# Altium schematic sheet Sheet_2.schdoc
size 307 x 218 mm
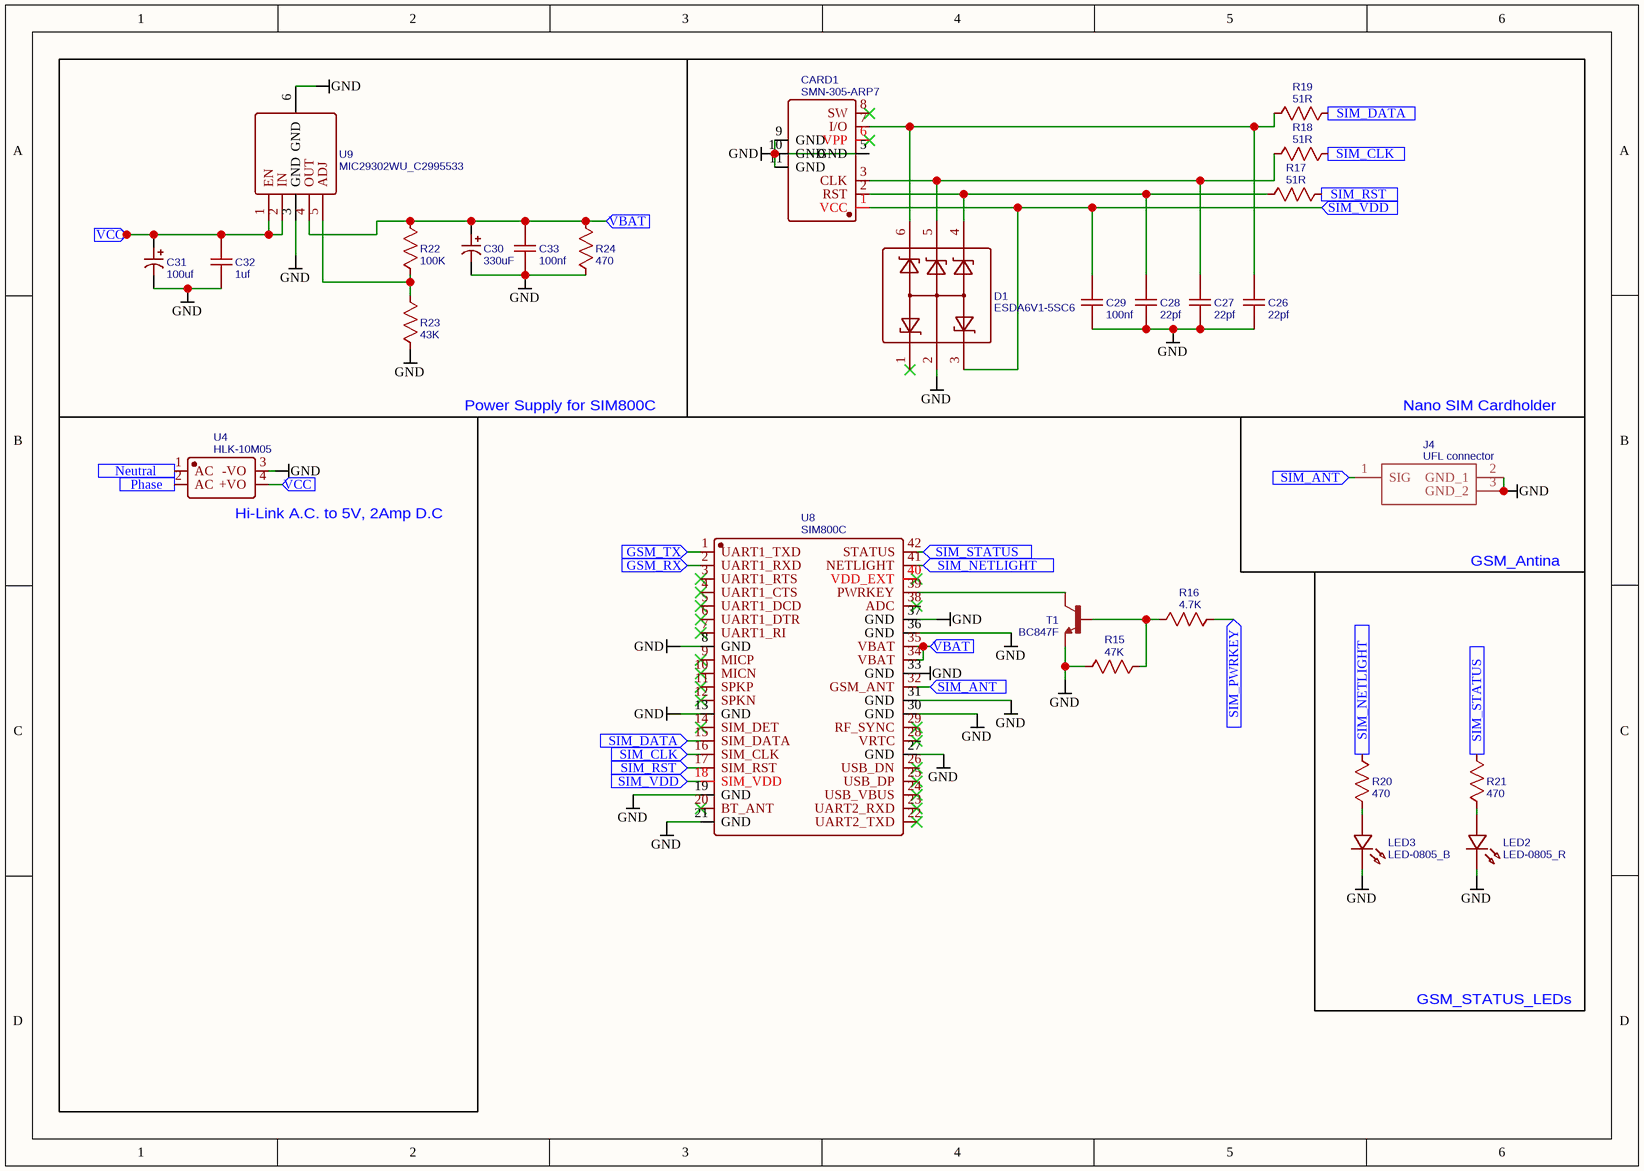
[diagram p0: Sheet_2.schdoc]

## Parts
C26  22pf  [C0805]
C27  22pf  [C0805]
C28  22pf  [C0805]
C29  100nf  [C0805]
C30  330uF  [CAP-SMD_BD10.0-L10.3-W10.3-LS10.8-FD]
C31  100uf  [CAP-SMD_BD10.0-L10.3-W10.3-LS10.8-FD]
C32  1uf  [C0805]
C33  100nf  [C0805]
CARD1  SMN-305-ARP7  [NANO-SIM-SMD_SMN-305-ARP7]
D1  ESDA6V1-5SC6  [SOT-23-6_L2.9-W1.6-P0.95-LS2.8-BR]
J4  UFL connector  [CONUFL001-SMD]
LED2  LED-0805_R  [LED0805_RED]
LED3  LED-0805_B  [LED0805_BLUE]
R15  47K  [R0805]
R16  4.7K  [R0805]
R17  51R  [R0805]
R18  51R  [R0805]
R19  51R  [R0805]
R20  470  [R0805]
R21  470  [R0805]
R22  100K  [R0805]
R23  43K  [R0805]
R24  470  [R0805]
T1  BC847F  [SOT490]
U4  HLK-10M05  [PWRM-TH_HLK-10M05]
U8  SIM800C  [GSM-SMD_42P-L17.6-W15.7-P1.10-TL]
U9  MIC29302WU_C2995533  [TO-263-5_L10.1-W8.7-P1.70-LS15.2-BR]

## Blocks framed on the sheet
Power Supply for SIM800C: C30-C33 R22-R24 U9
Nano SIM Cardholder: C26-C29 CARD1 D1 R17-R19
Hi-Link A.C. to 5V, 2Amp D.C: U4

## Ports
GSM_RX (in), GSM_TX (in), Neutral (in), Phase (in), SIM_ANT (in), SIM_CLK (in), SIM_DATA (in), SIM_NETLIGHT (in), SIM_PWRKEY (in), SIM_RST (in), SIM_STATUS (in), SIM_VDD (in), VBAT (in), VCC (in)

## Nets
GND: C26.1 C27.1 C28.1 C29.1 C30.2 C31.2 C32.1 C33.1 CARD1.5(GND) CARD1.9(GND) CARD1.10(GND) CARD1.11(GND) D1.2(GND) J4.2(GND_1) J4.3(GND_2) LED2.2 LED3.2 R15.1 R23.1 R24.2 T1.2(E) U4.3(-VO) U8.8(GND) U8.13(GND) U8.19(GND) U8.21(GND) U8.27(GND) U8.30(GND) U8.31(GND) U8.33(GND) U8.36(GND) U8.37(GND) U9.3(GND) U9.6(GND)
GSM_RX: U8.2(UART1_RXD) ; port GSM_RX
GSM_TX: U8.1(UART1_TXD) ; port GSM_TX
Neutral: U4.1(AC) ; port Neutral
Phase: U4.2(AC) ; port Phase
SIM_ANT: J4.1(SIG) U8.32(GSM_ANT) ; port SIM_ANT
SIM_CLK: R18.2 U8.16(SIM_CLK) ; port SIM_CLK
SIM_DATA: R19.2 U8.15(SIM_DATA) ; port SIM_DATA
SIM_NETLIGHT: R20.1 U8.41(NETLIGHT) ; port SIM_NETLIGHT
SIM_PWRKEY: R16.2 ; port SIM_PWRKEY
SIM_RST: R17.2 U8.17(SIM_RST) ; port SIM_RST
SIM_STATUS: R21.1 U8.42(STATUS) ; port SIM_STATUS
SIM_VDD: C29.2 CARD1.1(VCC) D1.3(IO2) U8.18(SIM_VDD) ; port SIM_VDD
VBAT: C30.1 C33.2 R22.2 R24.1 U8.34(VBAT) U8.35(VBAT) U9.4(OUT) ; port VBAT
VCC: C31.1 C32.2 U4.4(+VO) U9.1(EN) U9.2(IN) ; port VCC
NetC26_2: C26.2 CARD1.7(I/O) D1.6(IO5) R19.1
NetC27_2: C27.2 CARD1.3(CLK) D1.5(IO4) R18.1
NetC28_2: C28.2 CARD1.2(RST) D1.4(IO3) R17.1
NetLED2_1: LED2.1 R21.2
NetLED3_1: LED3.1 R20.2
NetR15_2: R15.2 R16.1 T1.1(B)
NetR22_1: R22.1 R23.2 U9.5(ADJ)
NetT1_3: T1.3(C) U8.39(PWRKEY)

Not connected (* = marked no-connect by the designer): CARD1 6(VPP)* 8(SW)*; D1 1(IO1)*; U8 3(UART1_RTS)* 4(UART1_CTS)* 5(UART1_DCD)* 6(UART1_DTR)* 7(UART1_RI)* 9(MICP)* 10(MICN)* 11(SPKP)* 12(SPKN)* 14(SIM_DET)* 20(BT_ANT)* 22(UART2_TXD)* 23(UART2_RXD)* 24(USB_VBUS)* 25(USB_DP)* 26(USB_DN)* 28(VRTC)* 29(RF_SYNC)* 38(ADC)* 40(VDD_EXT)*

## Notes on the sheet
- GSM_Antina
- GSM_STATUS_LEDs

## Library data of the parts
C26-C28 = 22pf: nameAlias: Value(F); Contributor: LCEDA_Lib; spicePre: C; spiceSymbolName: C_0805_US
C29 C33 = 100nf: nameAlias: Value(F); Contributor: LCEDA_Lib; spicePre: C; spiceSymbolName: C_0805_US
C30 = 330uF: Manufacturer: KNSCHA(科尼盛); Manufacturer Part: LZ330UF35V90RV0141; Contributor: lcsc; nameAlias: Capacitance; Supplier: LCSC; Supplier Part: C5155335; spicePre: C; spiceSymbolName: LZ330UF35V90RV0141
C31 = 100uf: Manufacturer: KNSCHA(科尼盛); Manufacturer Part: LZ330UF35V90RV0141; Contributor: lcsc; nameAlias: Capacitance; Supplier: LCSC; Supplier Part: C5155335; spicePre: C; spiceSymbolName: LZ330UF35V90RV0141
C32 = 1uf: nameAlias: Value(F); Contributor: LCEDA_Lib; spicePre: C; spiceSymbolName: C_0805_US
CARD1 = SMN-305-ARP7: Manufacturer: XUNPU(讯普); Contributor: LCSC; Supplier: LCSC; Supplier Part: C720512; Manufacturer Part: SMN-305-ARP7; JLCPCB Part Class: Extended Part; spicePre: C; spiceSymbolName: SMN-305-ARP7
D1 = ESDA6V1-5SC6: Manufacturer: ST(意法半导体); Supplier: LCSC; Manufacturer Part: ESDA6V1-5SC6; Supplier Part: C6650; JLCPCB Part Class: Extended Part; spicePre: D; spiceSymbolName: ESDA6V1-5SC6
J4 = UFL connector: Contributor: BzuV; spicePre: J; spiceSymbolName: UFL connector
LED2 = LED-0805_R: Manufacturer: EVERLIGHT(台湾亿光); Manufacturer Part: 17-21SURC/S530-A3/TR8; Contributor: LCEDA_Lib; Supplier Part: C72037; spicePre: L; spiceSymbolName: LED-0805_R
LED3 = LED-0805_B: Manufacturer: 方舟 ARKLED; Manufacturer Part: D-B080508B1-KS2; Contributor: LCEDA_Lib; Supplier Part: C108412; spicePre: L; spiceSymbolName: LED-0805_B
R15 = 47K: nameAlias: Value(Ω); Contributor: LCEDA_Lib; spicePre: R; spiceSymbolName: R_0805_US
R16 = 4.7K: nameAlias: Value(Ω); Contributor: LCEDA_Lib; spicePre: R; spiceSymbolName: R_0805_US
R17-R19 = 51R: nameAlias: Value(Ω); Contributor: LCEDA_Lib; spicePre: R; spiceSymbolName: R_0805_US
R20 R21 R24 = 470: nameAlias: Value(Ω); Contributor: LCEDA_Lib; spicePre: R; spiceSymbolName: R_0805_US
R22 = 100K: nameAlias: Value(Ω); Contributor: LCEDA_Lib; spicePre: R; spiceSymbolName: R_0805_US
R23 = 43K: nameAlias: Value(Ω); Contributor: LCEDA_Lib; spicePre: R; spiceSymbolName: R_0805_US
U4 = HLK-10M05: Manufacturer: HI-LINK(海凌科); Contributor: LCSC; Supplier: LCSC; Supplier Part: C403745; Manufacturer Part: HLK-10M05; JLCPCB Part Class: Extended Part; spicePre: U; spiceSymbolName: HLK-10M05
U8 = SIM800C: Manufacturer: null; Contributor: LCSC; Supplier: LCSC; Supplier Part: C9900011152; Manufacturer Part: SIM800C; JLCPCB Part Class: Extended Part; spicePre: U; spiceSymbolName: SIM800C
U9 = MIC29302WU_C2995533: Manufacturer: UMW(广东友台半导体); Contributor: lcsc; Supplier: LCSC; Supplier Part: C2995533; Manufacturer Part: MIC29302WU; link: https://atta.szlcsc.comnull; JLCPCB Part Class: Extended Part; spicePre: U; spiceSymbolName: MIC29302WU_C2995533
T1 = BC847F: spicePre: T; spiceSymbolName: BC847F